# EasyEDA Pro project ProPrj_主控板v1.0_2025-02-24.epro, board PCB5
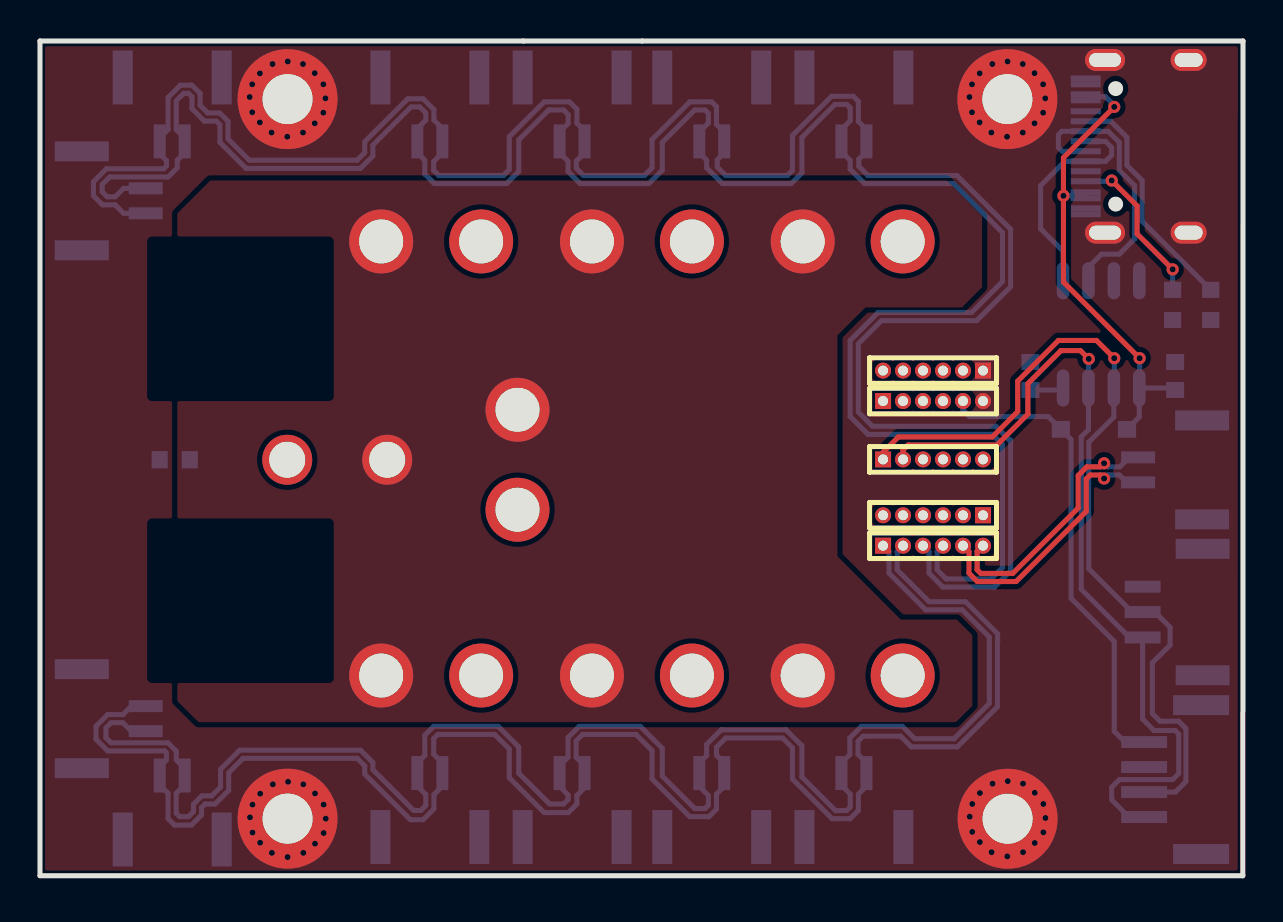
[diagram p12: board, top side]
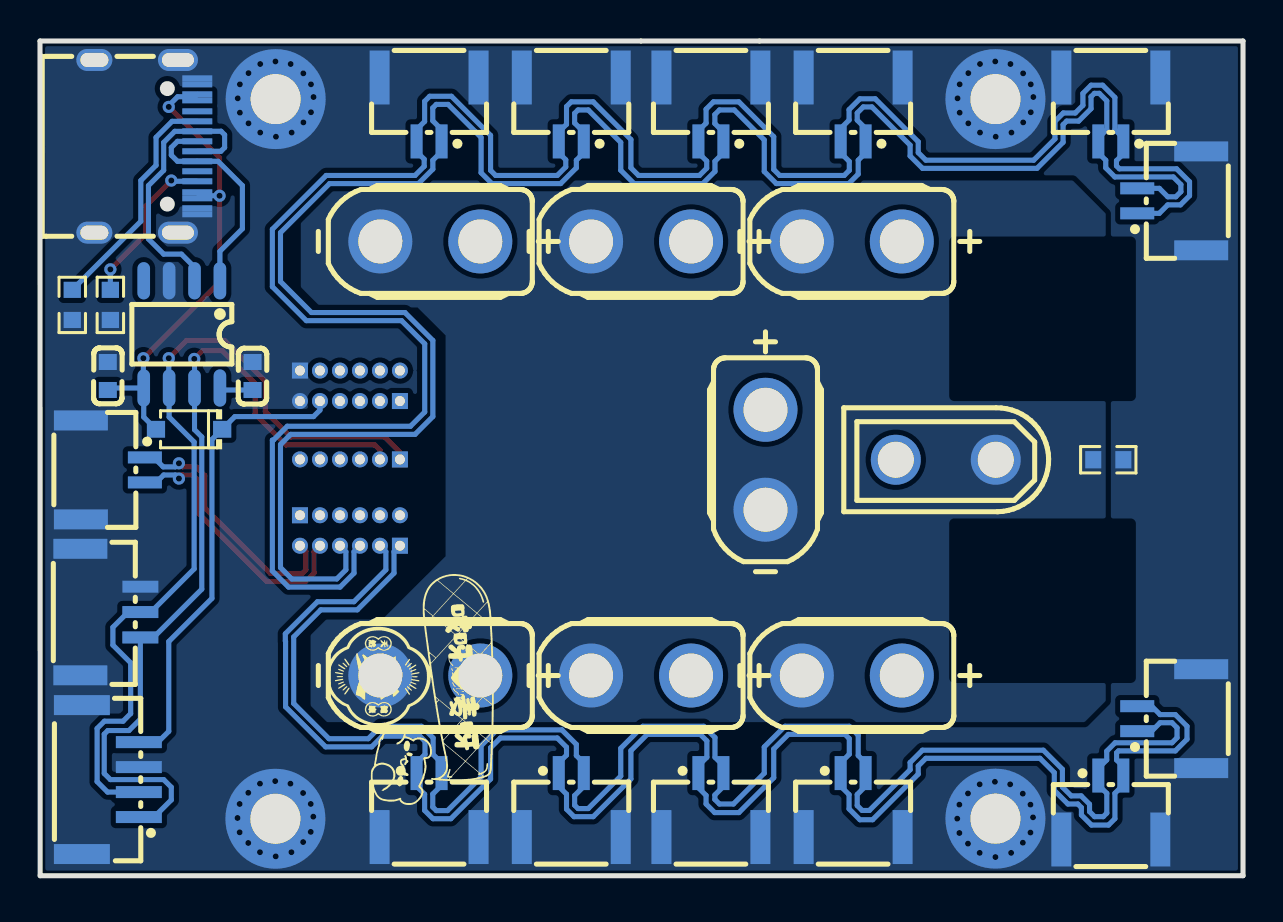
[diagram p13: board, bottom side, seen from below]

Outline 60.17 x 41.76 mm; copper layers: Top Layer, Bottom Layer. Coordinates in mm from the lower left corner of the outline.
Outline path: 0,0 0,41.76 60.17,41.76 60.16,0 0,0
Stack: Top Layer 0.035mm / Dielectric1 1.51mm FR4 er 4.5 / Bottom Layer 0.035mm

## Design rules (mm)
net CAN2-L: DP1
net CAN2-H: DP1
net CAN1-L: DP2
net CAN1-H: DP2
net RS485_1_B: DP3
net RS485_1_A: DP3
template: 自定义配置
spacing copperThickness1oz (default): track to track 0.102, other pairs 0.152 to 0.3
spacing copperThickness2oz: track to track 0.203, other pairs 0.152 to 0.3
track width copperThickness1oz (default): min 0.127, default 0.254, max 2.54
track width copperThickness2oz: min 0.203, default 0.254, max 2.54
differential pair differentialPair (default): width min 0.127, default 0.254, max 2.54; gap min 0.152, default 0.152
via viaSize (default): diameter min 0.5, default 0.61, max 10; hole min 0.3, default 0.305, max 6.3

## Placement (name value [footprint] x y rotation side)
C1  100nF  [C0603]  49.54 25 90 bottom
C2  100nF  [C0603]  56.78 25 270 bottom
CN11  GH1.25-2P卧贴  [CONN-SMD_2P-P1.25_X1251WRS-02HF-LPSW]  6.61 38.34 0 bottom
CN12  GH1.25-2P卧贴  [CONN-SMD_2P-P1.25_X1251WRS-02HF-LPSW]  33.6 38.34 0 bottom
CN13  GH1.25-2P卧贴  [CONN-SMD_2P-P1.25_X1251WRS-02HF-LPSW]  26.61 38.34 0 bottom
CN14  GH1.25-2P卧贴  [CONN-SMD_2P-P1.25_X1251WRS-02HF-LPSW]  3.69 7.86 90 bottom
CN15  GH1.25-2P卧贴  [CONN-SMD_2P-P1.25_X1251WRS-02HF-LPSW]  19.5 3.53 180 bottom
CN16  GH1.25-2P卧贴  [CONN-SMD_2P-P1.25_X1251WRS-02HF-LPSW]  33.6 3.53 180 bottom
CN17  GH1.25-2P卧贴  [CONN-SMD_2P-P1.25_X1251WRS-02HF-LPSW]  56.52 20.3 270 bottom
CN19  GH1.25-2P卧贴  [CONN-SMD_2P-P1.25_X1251WRS-02HF-LPSW]  19.5 38.34 0 bottom
CN20  GH1.25-2P卧贴  [CONN-SMD_2P-P1.25_X1251WRS-02HF-LPSW]  26.61 3.53 180 bottom
CN21  GH1.25-2P卧贴  [CONN-SMD_2P-P1.25_X1251WRS-02HF-LPSW]  40.71 38.34 0 bottom
CN22  GH1.25-2P卧贴  [CONN-SMD_2P-P1.25_X1251WRS-02HF-LPSW]  40.71 3.53 180 bottom
CN23  XT30UPB-F30.G.Y  [CONN-TH_XT30UPB-F]  19.57 31.73 0 bottom
CN24  XT30UPB-F30.G.Y  [CONN-TH_XT30UPB-F]  30.11 31.73 0 bottom
CN25  XT30UPB-F30.G.Y  [CONN-TH_XT30UPB-F]  40.65 31.73 0 bottom
CN26  XT30UPB-F30.G.Y  [CONN-TH_XT30UPB-F]  19.57 10.02 0 bottom
CN27  XT30UPB-F30.G.Y  [CONN-TH_XT30UPB-F]  30.11 10.02 0 bottom
CN28  XT30UPB-F30.G.Y  [CONN-TH_XT30UPB-F]  40.65 10.02 0 bottom
CN29  XT30UPB-F30.G.Y  [CONN-TH_XT30UPB-F]  23.88 20.81 270 bottom
CN30  GH1.25-2P卧贴  [CONN-SMD_2P-P1.25_X1251WRS-02HF-LPSW]  3.69 33.77 90 bottom
CN31  GH1.25-2P卧贴  [CONN-SMD_2P-P1.25_X1251WRS-02HF-LPSW]  6.61 3.41 180 bottom
CN32  XT30UPB-M  [CONN-TH_XT30UPB-M]  14.87 20.81 0 bottom
NOREF  -  [Pad_e253]  48.39 2.85 90 top
NOREF#2  -  [Pad_e252]  48.38 38.85 90 top
NOREF#3  -  [Pad_e250]  12.38 2.85 90 top
NOREF#4  -  [Pad_e251]  12.38 38.85 90 top
R161  22R  [R0603]  56.65 28.56 90 bottom
R162  22R  [R0603]  58.55 28.56 270 bottom
R163  0R  [R0603]  6.74 20.81 180 bottom
U20  SD103AWS  [SOD-123_L2.7-W1.7-LS3.8-RD]  52.71 22.34 0 bottom
U33  GH1.25-4P卧贴  [CONN-SMD_4P-P1.25_GH1.25-4P]  56.65 4.81 270 bottom
U36  GH1.25-3PWBPZ  [CONN-SMD_GH1.25-3PWBPZ]  56.65 13.19 270 bottom
U38  HX PZ1.0-1x6P ZZ  [HDR-TH_6P-P1.00-V-M]  44.67 20.83 0 top
U39  HX PZ1.0-1x6P ZZ  [HDR-TH_6P-P1.00-V-M]  44.67 18.03 180 top
U40  HX PZ1.0-1x6P ZZ  [HDR-TH_6P-P1.00-V-M]  44.67 16.51 0 top
U41  HX PZ1.0-1x6P ZZ  [HDR-TH_6P-P1.00-V-M]  44.67 25.27 180 top
U42  HX PZ1.0-1x6P ZZ  [HDR-TH_6P-P1.00-V-M]  44.67 23.75 0 top
U43  CH340N  [SOP-8_L4.9-W3.9-P1.27-LS6.0-BL]  53.08 27.08 0 bottom
USB1  TYPE-C母座16P不绣钢  [TYPE-C-SMD_16P-EH4]  54.88 36.49 270 bottom

## Footprints (pads in the part's own frame, mm; a bottom-side part is the same pattern mirrored in y, then rotated)
C0603
  rect 0.8x0.9 smd: 1(-0.7,0) 2(0.7,0)
CONN-SMD_2P-P1.25_X1251WRS-02HF-LPSW
  rect 0.6x1.7 smd: 1(-0.625,1.6) 2(0.625,1.6)
  rect 1x2.7 smd: 3(2.475,-1.6) 4(-2.475,-1.6)
CONN-SMD_4P-P1.25_GH1.25-4P
  rect 0.6x2.3 smd: 1(1.875,1.425) 2(0.625,1.425) 3(-0.625,1.425) 4(-1.875,1.425)
  rect 1x2.8 smd: 5(-3.725,-1.425) 6(3.725,-1.425)
CONN-SMD_GH1.25-3PWBPZ
  rect 0.6x1.8 smd: 1(-1.27,1.501) 2(0,1.501) 3(1.27,1.501)
  rect 1x2.7 smd: 4(-3.163,-1.501) 5(3.163,-1.501)
CONN-TH_XT30UPB-F
  round 3.2 hole 2.2: 1(-2.5,0) 2(2.5,0)
CONN-TH_XT30UPB-M
  round 2.5 hole 1.8: 1(-2.5,0) 2(2.5,0)
HDR-TH_6P-P1.00-V-M
  rect 0.8x0.8 hole 0.5: 1(-2.5,0)
  round 0.8 hole 0.5: 2(-1.5,0) 3(-0.5,0) 4(0.5,0) 5(1.5,0) 6(2.5,0)
Pad_e250
  round 5 hole 2.5: 101(0,0)
Pad_e251
  round 5 hole 2.5: 101(0,0)
Pad_e252
  round 5 hole 2.5: 101(0,0)
Pad_e253
  round 5 hole 2.5: 101(0,0)
R0603
  rect 0.806x0.864 smd: 1(-0.753,0) 2(0.753,0)
SOD-123_L2.7-W1.7-LS3.8-RD
  rect 0.91x0.84 smd: 1(-1.655,0) 2(1.655,0)
SOP-8_L4.9-W3.9-P1.27-LS6.0-BL
  oval 0.63x1.865 smd: 1(-1.905,-2.683) 2(-0.635,-2.683) 3(0.635,-2.683) 4(1.905,-2.683) 5(1.905,2.683) 6(0.635,2.683) 7(-0.635,2.683) 8(-1.905,2.683)
TYPE-C-SMD_16P-EH4
  oval 1.1x1.8 hole 0.7x1.4: 1(-4.32,-2.574) 1(4.32,-2.574)
  oval 1.1x2 hole 0.7x1.6: 1(-4.32,1.606) 1(4.32,1.606)
  rect 0.3x1.5 smd: A1(-3.4,2.573) A4(-2.6,2.573) A5(-1.25,2.573) A6(-0.25,2.573) A7(0.25,2.573) A8(1.25,2.574) A9(2.6,2.574) A12(3.4,2.573) B1(3.1,2.573) B4(2.3,2.574) B5(1.75,2.573) B6(0.75,2.573) B7(-0.75,2.573) B8(-1.75,2.574) B9(-2.3,2.573) B12(-3.1,2.573)

## Nets
As in the schematic, except:
GND: C1.2 C2.1 CN11.3 CN11.4 CN12.3 CN12.4 CN13.3 CN13.4 CN14.3 CN14.4 CN15.3 CN15.4 CN16.3 CN16.4 CN17.3 CN17.4 CN19.3 CN19.4 CN20.3 CN20.4 CN21.3 CN21.4 CN22.3 CN22.4 CN30.3 CN30.4 CN31.3 CN31.4 NOREF.101 NOREF#2.101 NOREF#3.101 NOREF#4.101 R161.1 R162.2 R163.2 U33.3 U33.5 U33.6 U36.1 U36.4 U36.5 U41.1 U42.6 U43.3 USB1.1 USB1.A1 USB1.A12 USB1.B1 USB1.B12

Pads without a net: U43 4; USB1 A8 B8

## Via types
v1: diameter 0.45, hole 0.3, Top Layer to Bottom Layer, 64 vias
v2: diameter 0.61, hole 0.305, Top Layer to Bottom Layer, 9 vias

## Routing (per net, layer and track width the routed paths; a pad name or vN(x,y) marks a point on that pad's centre or on a via; arc(x,y) is an arc through that point)
GND:
  vias: v1(10.49,38.96) v1(10.5,2.92) v1(10.61,39.59) v1(10.61,38.2) v1(10.63,3.56) v1(10.63,2.16) v1(11,40.14) v1(11,37.69) v1(11.01,4.1) v1(11.01,1.65) v1(11.63,40.61) v1(11.58,37.18) v1(11.65,4.57) v1(11.6,1.14) v1(12.39,40.74) v1(12.37,36.97) v1(12.41,4.7) v1(12.38,0.93) v1(13.15,40.61) v1(13.15,37.18) v1(13.17,4.57) v1(13.17,1.14) v1(13.74,40.15) v1(13.74,37.64) v1(13.76,4.12) v1(13.76,1.6) v1(14.17,39.59) v1(14.17,38.18) v1(14.19,3.56) v1(14.19,2.14) v1(14.28,38.89) v1(14.29,2.85) v1(46.49,38.96) v1(46.5,2.95) v1(46.61,39.59) v1(46.61,38.2) v1(46.63,3.59) v1(46.63,2.19) v1(47,40.14) v1(47,37.69) v1(47.01,4.14) v1(47.01,1.68) v1(47.63,40.61) v1(47.58,37.18) v1(47.64,4.61) v1(47.59,1.18) v1(48.39,40.74) v1(48.37,36.97) v1(48.4,4.73) v1(48.38,0.97) v1(49.15,40.61) v1(49.15,37.18) v1(49.17,4.61) v1(49.17,1.18) v1(49.74,40.15) v1(49.74,37.64) v1(49.75,4.15) v1(49.75,1.64) v1(50.17,39.59) v1(50.17,38.18) v1(50.18,3.59) v1(50.18,2.17) v1(50.28,38.89) v1(50.29,2.89)
VCC_5V: length 23.7
  Bottom Layer w0.254: U42.5 46.17,23.29 46.49,22.97 50.42,22.97 U20.1 51.57,21.82 51.57,13.88 53.73,11.72 53.73,7.22 54.27,6.68 U33.4
CAN1-H: length 113.7
  Bottom Layer w0.254: CN30.2 4.19,34.39 3.76,33.97 3.36,33.97 3.11,34.22 3.11,34.58 3.49,34.96 6.41,34.96 6.87,35.42 6.87,35.8 7.24,36.17 CN11.2 7.24,36.91 6.81,37.33 6.81,38.77 7.19,39.14 7.43,39.14 7.6,38.97 7.6,38.37 8.22,37.75 8.82,37.75 9,37.58 9,36.69 10.3,35.39 16.03,35.39 16.65,36.01 16.65,36.55 18.56,38.46 18.99,38.46 19.3,38.16 19.3,37.8 18.88,37.38 18.88,36.17 19.25,35.8 19.25,35.1 19.72,34.63 23.34,34.63 23.95,35.23 23.95,36.81 25.44,38.31 26.19,38.31 26.42,38.08 26.42,37.63 25.99,37.2 CN13.1 25.99,36.17 26.41,35.75 26.41,35.24 27.02,34.63 30.45,34.63 31.12,35.3 31.12,36.69 32.75,38.31 33.26,38.31 33.43,38.14 33.43,37.66 32.97,37.2 CN12.1 32.97,36.17 33.34,35.8 33.34,35.41 34.13,34.63 37.57,34.63 38.11,35.17 38.11,36.94 39.76,38.59 40.35,38.59 40.52,38.41 40.52,37.77 40.08,37.33 CN21.1 40.08,36.23 40.52,35.8 40.52,35.35 41.24,34.63 45.69,34.63 48.14,32.17 48.14,29.73 46.59,28.18 41.92,28.18 40.52,26.78 40.52,22.97 41.41,22.08 47.63,22.08 48.14,21.57 48.14,15.42 47.57,14.85 45.33,14.85 44.87,15.31 44.87,16.21 U40.4
CAN1-L: length 117.4
  Bottom Layer w0.254: 27.24,36.87 27.24,37.27 26.86,37.65 26.86,38.35 26.49,38.72 25.22,38.72 23.47,36.97 23.47,35.33 23.17,35.04 19.95,35.04 19.69,35.29 19.69,35.74 20.13,36.17 20.13,37.38 19.7,37.8 19.7,38.33 19.16,38.87 18.39,38.87 16.24,36.72 16.24,36.18 15.86,35.8 10.47,35.8 9.41,36.86 9.41,37.74 8.99,38.16 8.39,38.16 8.01,38.54 8.01,39.14 7.6,39.55 7.02,39.55 6.41,38.94 6.41,37.33 5.99,36.91 CN11.1 5.99,36.12 6.33,35.78 6.33,35.52 6.18,35.37 3.32,35.37 2.67,34.72 2.67,34.02 3.13,33.56 3.76,33.56 4.19,33.14 CN30.1 ; 27.24,36.87 CN13.2 ; 27.24,36.87 27.25,36.86 27.25,36.18 26.82,35.76 26.82,35.4 27.19,35.04 30.23,35.04 30.61,35.42 30.61,36.83 32.5,38.72 33.6,38.72 33.84,38.48 33.84,37.59 34.22,37.2 34.22,36.17 33.87,35.82 33.87,35.46 34.3,35.04 37.38,35.04 37.63,35.29 37.63,37.04 39.59,39 40.68,39 40.93,38.74 40.93,37.73 41.33,37.33 CN21.2 41.33,36.23 40.95,35.85 40.95,35.49 41.41,35.04 45.85,35.04 48.55,32.34 48.55,29.47 46.85,27.77 42.09,27.77 40.93,26.61 40.93,23.2 41.64,22.49 47.8,22.49 48.49,21.79 48.55,21.79 48.55,15.25 47.74,14.44 45.16,14.44 44.46,15.14 44.46,16.21 U40.3
CAN2-H: length 92
  Bottom Layer w0.254: 27.24,4.8 27.24,4.4 26.86,4.02 26.86,3.59 26.42,3.16 25.21,3.16 23.47,4.9 23.47,6.34 22.74,7.07 19.9,7.07 19.69,6.86 19.69,6.08 20.13,5.65 20.13,4.48 19.7,4.06 19.7,3.34 19.16,2.8 18.53,2.8 16.24,5.08 16.24,5.49 15.86,5.87 10.16,5.87 9.44,5.16 9.44,4.27 8.76,3.59 8.26,3.59 8.08,3.41 8.08,3.04 7.58,2.53 6.73,2.53 6.41,2.85 6.41,4.12 5.99,4.55 CN31.2 5.99,5.45 6.32,5.79 6.32,6.15 6.23,6.24 3.39,6.24 2.8,6.83 2.8,7.48 3.39,8.06 4.15,8.06 4.57,8.48 CN14.2 ; 27.24,4.8 27.25,4.93 ; 27.24,4.8 27.25,4.81 27.25,4.93 ; 41.33,4.93 41.33,4.48 40.93,4.08 40.93,3.27 40.52,2.85 39.62,2.85 37.63,4.84 37.63,6.4 37.14,6.89 34.3,6.89 33.84,6.43 33.84,6.03 34.22,5.65 34.22,4.47 33.84,4.08 33.84,3.33 33.46,2.95 32.5,2.95 30.61,4.84 30.61,6.26 29.8,7.07 27.14,7.07 26.82,6.74 26.82,5.93 27.25,5.49 27.25,4.93 ; CN22.1 41.33,5.65 40.91,6.07 40.91,6.73 41.17,6.98 43.05,6.98 43.58,6.45 45.88,6.45 47.89,8.45 47.89,11.73 47.9,11.74 47.9,12.1 46.29,13.71 44.47,13.71 42.87,15.31 42.87,16.21 U40.2
CAN2-L: length 89.7
  Bottom Layer w0.254: U40.1 42.46,16.21 42.46,15.14 44.3,13.3 46.12,13.3 47.48,11.95 47.48,8.62 45.71,6.85 43.75,6.85 43.13,7.48 41.09,7.48 40.51,6.89 40.51,6.07 40.08,5.64 CN22.2 ; 40.08,4.93 40.08,4.52 40.52,4.08 40.52,3.44 40.35,3.26 39.79,3.26 38.11,4.94 38.11,6.5 37.31,7.3 34.07,7.3 33.34,6.57 33.34,6.01 32.97,5.64 32.97,4.47 33.43,4.01 33.43,3.53 33.26,3.36 32.75,3.36 31.12,4.99 31.12,6.37 30.02,7.48 26.97,7.48 26.41,6.91 26.41,5.92 25.99,5.5 25.99,4.47 26.42,4.04 26.42,3.82 26.19,3.59 25.49,3.59 23.95,5.13 23.95,6.44 22.91,7.48 19.69,7.48 19.25,7.03 19.25,6.01 18.88,5.64 18.88,4.48 19.3,4.06 19.3,3.51 19.05,3.26 18.69,3.26 16.65,5.3 16.65,5.66 16.03,6.28 9.99,6.28 9.03,5.33 9.03,4.44 8.59,3.99 8.09,3.99 7.68,3.58 7.68,3.21 7.42,2.95 6.99,2.95 6.81,3.13 6.81,4.12 7.24,4.55 CN31.1 7.24,5.37 6.82,5.79 6.82,6.23 6.4,6.65 3.55,6.65 3.3,6.9 3.3,7.4 3.55,7.65 4.15,7.65 4.57,7.23 CN14.1
PB10: length 43.5
  Top Layer w0.254: U38.1 42.17,21.19 42.93,21.95 47.63,21.95 48.9,23.22 48.9,24.75 50.93,26.78 52.84,26.78 v2(53.73,25.89)
  Bottom Layer w0.254: U33.2 56.79,4.18 57.31,4.71 57.31,7.37 56.95,7.73 56.01,7.73 55.63,8.11 55.63,10.65 56.52,11.54 56.52,12.43 55.76,13.19 U36.2 54.62,13.19 52.46,15.35 52.46,21.7 53.71,22.95 U43.6 53.73,24.42 v2(53.73,25.89)
PB11: length 43.1
  Top Layer w0.254: U38.2 43.17,21.3 43.42,21.55 47.87,21.55 49.41,23.1 49.41,24.62 51.06,26.27 52.04,26.27 v2(52.45,25.86)
  Bottom Layer w0.254: U33.1 54.46,2.93 53.6,3.79 53.6,4.43 53.98,4.81 56.65,4.81 56.96,5.12 56.96,7.08 56.78,7.26 55.72,7.26 55.15,7.83 U36.3 54.49,11.92 52.08,14.33 52.08,21.95 52.44,22.32 U43.7 52.44,25.84 v2(52.45,25.86)
RS485_1_A: length 13
  Top Layer w0.254: v2(53.22,20.63) 53.04,20.46 52.36,20.46 51.92,20.02 51.92,18.4 48.65,15.13 47.05,15.13 46.87,15.31 46.87,16.24 47.14,16.51 U40.6
  Bottom Layer w0.254: CN17.1 54.48,20.93 54.01,20.46 53.4,20.46 v2(53.22,20.63)
RS485_1_B: length 13.6
  Top Layer w0.254: v2(53.22,19.87) 53.04,20.05 52.53,20.05 52.33,19.86 52.33,18.23 48.82,14.72 46.88,14.72 46.46,15.14 46.46,16.21 U40.5
  Bottom Layer w0.254: CN17.2 54.35,19.68 53.98,20.05 53.4,20.05 v2(53.22,19.87)
USB-DM: length 14.1
  Bottom Layer w0.254: U43.2 52.44,30.44 53.09,31.1 53.98,31.1 54.74,31.86 54.74,34.53 53.98,35.29 53.98,36.69 53.43,37.24 USB1.B7 52.3,37.25 51.11,37.25 50.93,37.07 50.93,36.43 51.12,36.24 USB1.A7
USB-DP: length 11.2
  Bottom Layer w0.254: U43.1 51.17,31.24 50.05,32.37 50.05,34.53 51.26,35.74 USB1.B6 53.29,35.74 53.6,36.05 53.6,36.43 53.29,36.74 USB1.A6
USB_VBUS: length 23.7
  Top Layer w0.254: v2(55,25.89) 51.19,29.7 v2(51.19,34.02) 51.19,35.92 v2(53.73,38.46)
  Bottom Layer w0.254: v2(51.19,34.02) 52.18,34.02 USB1.A9 ; C2.2 56.68,24.4 U43.5 ; USB1.A4 52.42,38.97 53.29,38.97 53.73,38.53 v2(53.73,38.46) ; U20.2 54.98,22.95 U43.5 ; v2(55,25.89) 55,24.42 U43.5
$1N1630: length 11.8
  Bottom Layer w0.254: R162.1 55.13,32.74 55.13,34.78 54.36,35.54 54.36,36.94 53.56,37.74 USB1.A5
$1N1647: length 8
  Top Layer w0.254: v2(53.6,34.78) 54.87,33.51 54.87,32.11 v2(56.65,30.34)
  Bottom Layer w0.254: USB1.B5 53.56,34.74 v2(53.6,34.78) ; R161.2 v2(56.65,30.34)
$1N2015: length 1.7
  Bottom Layer w0.254: C1.1 51.07,24.3 U43.8

## Copper pours and planes (outline as drawn; the poured copper is in the pictures)
GND on Top Layer: -3.04,43.93 60.97,43.93 62.62,42.27 62.62,-2.81 61.6,-3.83 -2.15,-3.83 -4.82,-1.16 -4.82,42.15
GND on Bottom Layer: -3.55,44.18 62.87,44.18 63.38,43.67 63.38,-4.59 63.13,-4.84 -3.04,-4.84 -4.95,-2.94 -4.95,42.78
PGND on Bottom Layer: 8.52,34.78 45.35,34.78 47.12,33 47.12,29.45 46.11,28.43 41.28,28.43 39.89,27.03 39.89,15.99 43.03,12.84 43.03,12.82 45.85,12.82 46.63,12.04 46.63,8.51 45.81,7.69 7.93,7.69 6.87,8.75 6.87,33.13
VCC_24V on Top Layer: 8.52,34.78 45.35,34.78 47.12,33 47.12,29.45 46.11,28.43 41.28,28.43 39.89,27.03 39.89,15.99 43.03,12.84 43.03,12.82 45.85,12.82 46.63,12.04 46.63,8.51 45.81,7.69 7.93,7.69 6.87,8.75 6.87,33.13
